# Altium project ek-ra8d2_mp - Customer.PrjPcb (part 3 of 5)

## Sheet RA8D2 MCU - Power.SchDoc
size A3; Company Name: Renesas Electronics America; CompanyURL: www.renesas.com; PageSetup: Record=PageOptions|CenterHorizontal=True|CenterVertical=True|PrintScale=1.00|XCorrection=1.00|YCorrection=1.00|PrintKind=1|BorderSize=5000000|LeftOffset=0|BottomOffset=0|Orientation=2|PaperLength=1000|PaperWidth=1000|Scale=100|PaperSource=7|PrintQuality=-4|MediaType=1|DitherType=10|PaperKind=A5 148x210mm|PrintScaleMode=1; ReleaseDate: 16.09.2025; Version: MP; SheetNumber: 10; SheetTotal: 18; VariantNumber: 0; DSheetNumber: 1
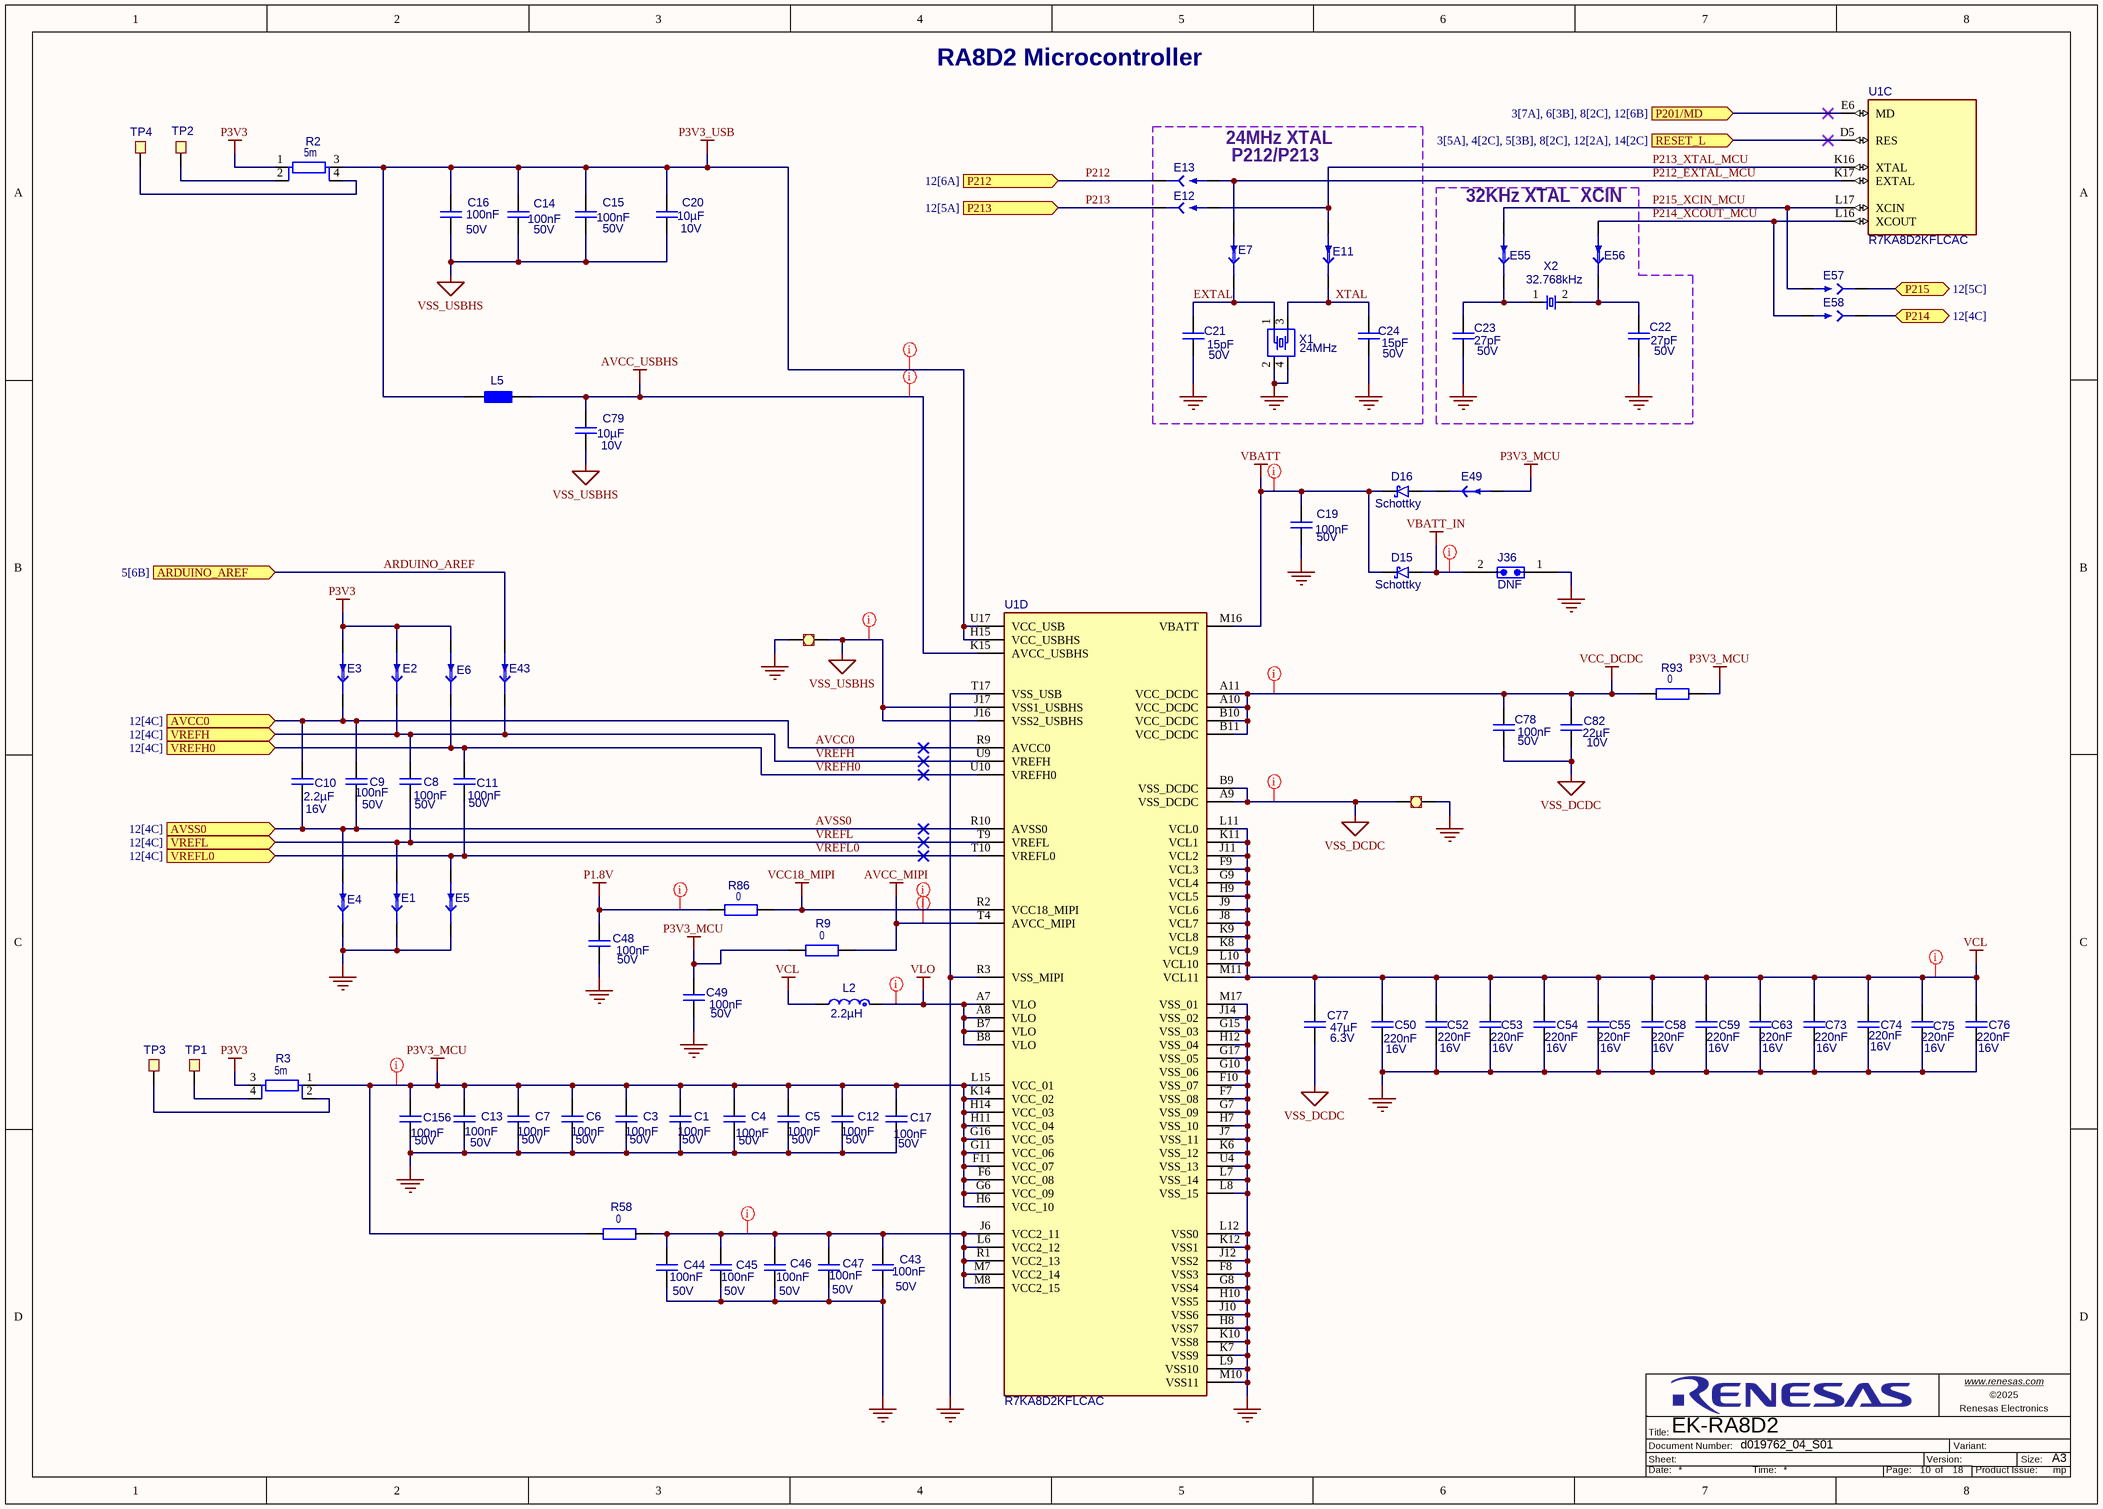
[diagram p9: RA8D2 MCU - Power.SchDoc]

### Parts
C1  value 100nF  Operating Voltage Max: 50V  [C_EIA0402_0p55]  (hidden comment: Capacitor)
C3  value 100nF  Operating Voltage Max: 50V  [C_EIA0402_0p55]  (hidden comment: Capacitor)
C4  value 100nF  Operating Voltage Max: 50V  [C_EIA0402_0p55]  (hidden comment: Capacitor)
C5  value 100nF  Operating Voltage Max: 50V  [C_EIA0402_0p55]  (hidden comment: Capacitor)
C6  value 100nF  Operating Voltage Max: 50V  [C_EIA0402_0p55]  (hidden comment: Capacitor)
C7  value 100nF  Operating Voltage Max: 50V  [C_EIA0402_0p55]  (hidden comment: Capacitor)
C8  value 100nF  Operating Voltage Max: 50V  [C_EIA0402_0p55]  (hidden comment: Capacitor)
C9  value 100nF  Operating Voltage Max: 50V  [C_EIA0402_0p55]  (hidden comment: Capacitor)
C10  value 2.2µF  Operating Voltage Max: 16V  [C_EIA0402_0p7]  (hidden comment: Capacitor)
C11  value 100nF  Operating Voltage Max: 50V  [C_EIA0402_0p55]  (hidden comment: Capacitor)
C12  value 100nF  Operating Voltage Max: 50V  [C_EIA0402_0p55]  (hidden comment: Capacitor)
C13  value 100nF  Operating Voltage Max: 50V  [C_EIA0402_0p55]  (hidden comment: Capacitor)
C14  value 100nF  Operating Voltage Max: 50V  [C_EIA0402_0p55]  (hidden comment: Capacitor)
C15  value 100nF  Operating Voltage Max: 50V  [C_EIA0402_0p55]  (hidden comment: Capacitor)
C16  value 100nF  Operating Voltage Max: 50V  [C_EIA0402_0p55]  (hidden comment: Capacitor)
C17  value 100nF  Operating Voltage Max: 50V  [C_EIA0402_0p55]  (hidden comment: Capacitor)
C19  value 100nF  Operating Voltage Max: 50V  [C_EIA0402_0p55]  (hidden comment: Capacitor)
C20  value 10µF  Operating Voltage Max: 10V  [C_EIA0402_0p7]  (hidden comment: Capacitor)
C21  value 15pF  Operating Voltage Max: 50V  [C_EIA0201_0p4]  (hidden comment: Capacitor)
C22  value 27pF  Operating Voltage Max: 50V  [C_EIA0402_0p55]  (hidden comment: Capacitor)
C23  value 27pF  Operating Voltage Max: 50V  [C_EIA0402_0p55]  (hidden comment: Capacitor)
C24  value 15pF  Operating Voltage Max: 50V  [C_EIA0201_0p4]  (hidden comment: Capacitor)
C43  value 100nF  Operating Voltage Max: 50V  [C_EIA0402_0p55]  (hidden comment: Capacitor)
C44  value 100nF  Operating Voltage Max: 50V  [C_EIA0402_0p55]  (hidden comment: Capacitor)
C45  value 100nF  Operating Voltage Max: 50V  [C_EIA0402_0p55]  (hidden comment: Capacitor)
C46  value 100nF  Operating Voltage Max: 50V  [C_EIA0402_0p55]  (hidden comment: Capacitor)
C47  value 100nF  Operating Voltage Max: 50V  [C_EIA0402_0p55]  (hidden comment: Capacitor)
C48  value 100nF  Operating Voltage Max: 50V  [C_EIA0402_0p55]  (hidden comment: Capacitor)
C49  value 100nF  Operating Voltage Max: 50V  [C_EIA0402_0p55]  (hidden comment: Capacitor)
C50  value 220nF  Operating Voltage Max: 16V  [C_EIA0402_0p55]  (hidden comment: Capacitor)
C52  value 220nF  Operating Voltage Max: 16V  [C_EIA0402_0p55]  (hidden comment: Capacitor)
C53  value 220nF  Operating Voltage Max: 16V  [C_EIA0402_0p55]  (hidden comment: Capacitor)
C54  value 220nF  Operating Voltage Max: 16V  [C_EIA0402_0p55]  (hidden comment: Capacitor)
C55  value 220nF  Operating Voltage Max: 16V  [C_EIA0402_0p55]  (hidden comment: Capacitor)
C58  value 220nF  Operating Voltage Max: 16V  [C_EIA0402_0p55]  (hidden comment: Capacitor)
C59  value 220nF  Operating Voltage Max: 16V  [C_EIA0402_0p55]  (hidden comment: Capacitor)
C63  value 220nF  Operating Voltage Max: 16V  [C_EIA0402_0p55]  (hidden comment: Capacitor)
C73  value 220nF  Operating Voltage Max: 16V  [C_EIA0402_0p55]  (hidden comment: Capacitor)
C74  value 220nF  Operating Voltage Max: 16V  [C_EIA0402_0p55]  (hidden comment: Capacitor)
C75  value 220nF  Operating Voltage Max: 16V  [C_EIA0402_0p55]  (hidden comment: Capacitor)
C76  value 220nF  Operating Voltage Max: 16V  [C_EIA0402_0p55]  (hidden comment: Capacitor)
C77  value 47µF  Operating Voltage Max: 6.3V  [C_EIA1206_1p8]  (hidden comment: GRM31CE70J476ME15L)
C78  value 100nF  Operating Voltage Max: 50V  [C_EIA0402_0p55]  (hidden comment: Capacitor)
C79  value 10µF  Operating Voltage Max: 10V  [C_EIA0402_0p7]  (hidden comment: Capacitor)
C82  value 22µF  Operating Voltage Max: 10V  [C_EIA1206_1p8]  (hidden comment: Capacitor)
C156  value 100nF  Operating Voltage Max: 50V  [C_EIA0402_0p55]  (hidden comment: Capacitor)
D15  Schottky  [roh_sod-123fl_pmdu]
D16  Schottky  [roh_sod-123fl_pmdu]
E1  TRACE_CUT_0805  [trace_cut_0805]  (value not drawn)  (net tie, no BOM)
E2  TRACE_CUT_0805  [trace_cut_0805]  (value not drawn)  (net tie, no BOM)
E3  TRACE_CUT_0805  [trace_cut_0805]  (value not drawn)  (net tie, no BOM)
E4  TRACE_CUT_0805  [trace_cut_0805]  (value not drawn)  (net tie, no BOM)
E5  TRACE_CUT_0805  [trace_cut_0805]  (value not drawn)  (net tie, no BOM)
E6  TRACE_CUT_0805  [trace_cut_0805]  (value not drawn)  (net tie, no BOM)
E7  TRACE_CUT_0805  [trace_cut_0805]  (value not drawn)  (net tie, no BOM)
E11  TRACE_CUT_0805  [trace_cut_0805]  (value not drawn)  (net tie, no BOM)
E12  SOLDER_BRIDGE_0805  [solder_bridge_0805]  (value not drawn)  (no BOM)
E13  SOLDER_BRIDGE_0805  [solder_bridge_0805]  (value not drawn)  (no BOM)
E43  TRACE_CUT_0805  [trace_cut_0805]  (value not drawn)  (net tie, no BOM)
E49  TRACE_CUT_0805  [trace_cut_0805]  (value not drawn)  (net tie, no BOM)
E55  TRACE_CUT_0805  [trace_cut_0805]  (value not drawn)  (net tie, no BOM)
E56  TRACE_CUT_0805  [trace_cut_0805]  (value not drawn)  (net tie, no BOM)
E57  SOLDER_BRIDGE_0805  [solder_bridge_0805]  (value not drawn)  (no BOM)
E58  SOLDER_BRIDGE_0805  [solder_bridge_0805]  (value not drawn)  (no BOM)
FS1  FS_Trace_120um  [force_sense_120um]  (value not drawn)  (net tie, no BOM)
FS2  FS_Trace_120um  [force_sense_120um]  (value not drawn)  (net tie, no BOM)
J36  CON_002  [wue_61300211121]  (value not drawn)
L2  value 2.2µH  [tdk_spm5020-lr]  (hidden comment: Inductor)
L5  MPZ1005S121CT000  [L_EIA0402]  (value not drawn)
R2  value 5m  [R_EIA0612]  (hidden comment: PS0612FKE070R005L)
R3  value 5m  [R_EIA0612]  (hidden comment: PS0612FKE070R005L)
R9  value 0  [R_EIA1206]  (hidden comment: Resistor)
R58  value 0  [R_EIA1206]  (hidden comment: Resistor)
R86  value 0  [R_EIA1206]  (hidden comment: Resistor)
R93  value 0  [R_EIA1206]  (hidden comment: Resistor)
TP1  TP_Mini  [key_5019]  (value not drawn)
TP2  TP_Mini  [key_5019]  (value not drawn)
TP3  TP_Mini  [key_5019]  (value not drawn)
TP4  TP_Mini  [key_5019]  (value not drawn)
U1  R7KA8D2KFLCAC  [ren_bga289_PRBG0289JA-A]  (parts C,D of 6)
X1  value 24MHz  [dio_FL]  (hidden comment: FL2400022)
X2  value 32.768kHz  [ABR_ABS07]  (hidden comment: ABS07-32.768KHZ-1-T)

### Blocks framed on the sheet
32KHz XTAL  XCIN: C22 C23 E55 E56 X2

### Ports
ARDUINO_AREF (in, see 5[6B]), AVCC0 (in, see 12[4C]), AVSS0 (in, see 12[4C]), P201/MD (in, see 3[7A], 6[3B], 8[2C], 12[6B]), P212 (in, see 12[6A]), P213 (in, see 12[5A]), P214 (bidir, see 12[4C]), P215 (bidir, see 12[5C]), RESET_L (in, see 3[5A], 4[2C], 5[3B], 8[2C], 12[2A], 14[2C]), VREFH0 (in, see 12[4C]), VREFH (in, see 12[4C]), VREFL0 (in, see 12[4C]), VREFL (in, see 12[4C])

### Nets
AVCC_MIPI: R9.2 U1.T4(AVCC_MIPI)
AVCC_USBHS: C79.1 L5.1 U1.K15(AVCC_USBHS)
GND: C1.1 C3.1 C4.1 C5.1 C6.1 C7.1 C12.1 C13.1 C17.1 C19.2 C21.2 C22.2 C23.2 C24.2 C43.1 C44.1 C45.1 C46.1 C47.1 C48.2 C49.2 C50.2 C52.2 C53.2 C54.2 C55.2 C58.2 C59.2 C63.2 C73.2 C74.2 C75.2 C76.2 C156.1 E1.1 E4.1 E5.1 FS1.1 FS2.2 J36.1 U1.F7(VSS_08) U1.F8(VSS3) U1.F10(VSS_07) U1.G7(VSS_09) U1.G8(VSS4) U1.G10(VSS_06) U1.G15(VSS_03) U1.G17(VSS_05) U1.H7(VSS_10) U1.H8(VSS7) U1.H10(VSS5) U1.H12(VSS_04) U1.J7(VSS_11) U1.J10(VSS6) U1.J12(VSS2) U1.J14(VSS_02) U1.K6(VSS_12) U1.K7(VSS9) U1.K10(VSS8) U1.K12(VSS1) U1.L7(VSS_14) U1.L8(VSS_15) U1.L9(VSS10) U1.L12(VSS0) U1.M10(VSS11) U1.M17(VSS_01) U1.R3(VSS_MIPI) U1.T17(VSS_USB) U1.U4(VSS_13) X1.2 X1.4
P1.8V: C48.1 R86.1
P3V3: E2.2 E3.2 E6.2 R2.1 R3.3
P3V3_MCU: C1.2 C3.2 C4.2 C5.2 C6.2 C7.2 C12.2 C13.2 C17.2 C49.1 C156.2 E49.2 R3.1 R9.1 R58.2 R93.2 U1.F6(VCC_08) U1.F11(VCC_07) U1.G6(VCC_09) U1.G11(VCC_06) U1.G16(VCC_05) U1.H6(VCC_10) U1.H11(VCC_04) U1.H14(VCC_03) U1.K14(VCC_02) U1.L15(VCC_01)
P3V3_USB: C14.1 C15.1 C16.1 C20.1 L5.2 R2.3 U1.H15(VCC_USBHS) U1.U17(VCC_USB)
VBATT: C19.1 D15.1(K) D16.1(K) U1.M16(VBATT)
VBATT_IN: D15.2(A) J36.2
VCC18_MIPI: R86.2 U1.R2(VCC18_MIPI)
VCC_DCDC: C78.1 C82.1 R93.1 U1.A10(VCC_DCDC) U1.A11(VCC_DCDC) U1.B10(VCC_DCDC) U1.B11(VCC_DCDC)
VCL: C50.1 C52.1 C53.1 C54.1 C55.1 C58.1 C59.1 C63.1 C73.1 C74.1 C75.1 C76.1 C77.1 L2.2 U1.F9(VCL3) U1.G9(VCL4) U1.H9(VCL5) U1.J8(VCL7) U1.J9(VCL6) U1.J11(VCL2) U1.K8(VCL9) U1.K9(VCL8) U1.K11(VCL1) U1.L10(VCL10) U1.L11(VCL0) U1.M11(VCL11)
VLO: L2.1 U1.A7(VLO) U1.A8(VLO) U1.B7(VLO) U1.B8(VLO)
VSS_DCDC: C77.2 C78.2 C82.2 FS2.1 U1.A9(VSS_DCDC) U1.B9(VSS_DCDC)
VSS_USBHS: C14.2 C15.2 C16.2 C20.2 C79.2 FS1.2 U1.J16(VSS2_USBHS) U1.J17(VSS1_USBHS)
ARDUINO_AREF: E43.2 ; port ARDUINO_AREF
AVCC0: C9.1 C10.2 E3.1 U1.R9(AVCC0) ; port AVCC0
AVSS0: C9.2 C10.1 E4.2 U1.R10(AVSS0) ; port AVSS0
EXTAL: C21.1 E7.1 X1.1
P201/MD: U1.E6(MD) ; port P201/MD
P212: E13.1 ; port P212
P212_EXTAL_MCU: E7.2 E13.2 U1.K17(EXTAL)
P213: E12.1 ; port P213
P213_XTAL_MCU: E11.2 E12.2 U1.K16(XTAL)
P214: E58.1 ; port P214
P214_XCOUT_MCU: E56.2 E58.2 U1.L16(XCOUT)
P215: E57.1 ; port P215
P215_XCIN_MCU: E55.2 E57.2 U1.L17(XCIN)
RESET_L: U1.D5(RES) ; port RESET_L
VREFH: C8.1 E2.1 E43.1 U1.U9(VREFH) ; port VREFH
VREFH0: C11.1 E6.1 U1.U10(VREFH0) ; port VREFH0
VREFL: C8.2 E1.2 U1.T9(VREFL) ; port VREFL
VREFL0: C11.2 E5.2 U1.T10(VREFL0) ; port VREFL0
XTAL: C24.1 E11.1 X1.3
NetC22_1: C22.1 E56.1 X2.2
NetC23_1: C23.1 E55.1 X2.1
NetC43_2: C43.2 C44.2 C45.2 C46.2 C47.2 R58.1 U1.J6(VCC2_11) U1.L6(VCC2_12) U1.M7(VCC2_14) U1.M8(VCC2_15) U1.R1(VCC2_13)
NetD16_2: D16.2(A) E49.1
NetR2_2: R2.2 TP2.1
NetR2_4: R2.4 TP4.1
NetR3_2: R3.2 TP3.1
NetR3_4: R3.4 TP1.1

### Layout directives
net class Power; rule Supply Nets [Voltage = 3.300]: NetC43_2, P1.8V, P3V3_MCU, VBATT, VBATT_IN, VCC_DCDC
net class Power; rule Supply Nets [Voltage = 1.200]: AVCC_USBHS, P3V3_USB, VCL, VLO
net class Power; rule Supply Nets [Voltage = 1.800]: AVCC_MIPI, VCC18_MIPI
net class Power; rule Supply Nets [Voltage = 0.000]: VSS_DCDC, VSS_USBHS

### Notes on the sheet
- RA8D2 Microcontroller
- (near E13) P212/P213
- 24MHz XTAL
- www.renesas.com <http://www.renesas.com>
- Sheet:
- Title:
- Document Number:
- Version:
- Variant:
- Renesas Electronics
- Size:
- A3
- Date:
- Time:
- Page:
- of
- Product Issue:

### Library data of the parts
C1 C3-C9 C11-C17 C19 C43-C49 C78 C156 = CAP-00003203-9: as C51 on sheet J-Link On Board with RA4M2; Dielectric: X7R; Height: 550µm; Operating Temperature Max: 125°C; Operating Temperature Min: -55°C
C10 = CAP-00000015-4: Capacitor,EIA0402,2.2u,16V,X6S; Tolerance: 10%; Qualification: AEC-Q200; Subtype: MLCC; Dielectric: X6S; Height: 700µm; Operating Temperature Max: 105°C; Operating Temperature Min: -55°C
C20 C79 = CAP-00003447-8: Capacitor,EIA0402,10u,10V,X5R; Tolerance: 20%; Subtype: MLCC; Dielectric: X5R; Height: 700µm; Operating Temperature Max: 85°C; Operating Temperature Min: -55°C; Qualification: -
C21 C24 = CAP-00000012-4: Capacitor,EIA0201,15p,50V,C0G; Tolerance: 1%; Qualification: AEC-Q200; Subtype: MLCC; Dielectric: C0G; Height: 390µm; Operating Temperature Max: 125°C; Operating Temperature Min: -55°C
C22 C23 = CAP-00003477-9: Capacitor,EIA0402,27p,50V,C0G; Tolerance: 5%; Subtype: MLCC; Remarks: ANY EQUIVALENT; Dielectric: C0G; Height: 550µm; Operating Temperature Max: 125°C; Operating Temperature Min: -55°C; Qualification: -
C50 C52-C55 C58 C59 C63 C73-C76 = CAP-00003208-9: Capacitor,EIA0402,220n,16V,X7R; Tolerance: 10%; Qualification: AEC-Q200; Subtype: MLCC; Dielectric: X7R; Height: 550µm; Operating Temperature Max: 125°C; Operating Temperature Min: -55°C
C77 = CAP-00003371-7: Capacitor,EIA1206,47u,6.3V,X7U; Tolerance: 20%; Subtype: MLCC; Operating Temperature Max: 125°C; Operating Temperature Min: -55°C; Dielectric: X7U; Height: 1.6mm; Qualification: -
C82 = CAP-00003207-7: Capacitor,EIA1206,22u,10V,X7R; Tolerance: 10%; Qualification: AEC-Q200; Subtype: MLCC; Dielectric: X7R; Height: 1.8mm; Operating Temperature Max: 125°C; Operating Temperature Min: -55°C
D15 D16 = DIO-00000005-3: Rectifier Diode, Schottky, 1 Phase, 1 Element, 1A, 40V V(RRM), Silicon; Forward Voltage: 600mV; Qualification: AEC-Q101; Current: 1A; Height: 900µm; Operating Temperature Max: 150°C; Operating Temperature Min: -55°C; Reverse Voltage: 40V; Subtype: Schottky
E1-E7 E11 E43 E49 E55 E56 = MIS-00000000-11: Trace Cut, SMD, 0805 size; Value: TC; Pin Count: 2; Qualification: -; Subtype: Trace Cut
E12 E13 E57 E58 = MIS-00000002-7: Solder Bridge, SMD, 0805 size; Value: SB; Subtype: Solder Bridge; Qualification: -; Pin Count: 2
FS1 FS2 = MIS-00003418-12: Force-Sense Trace 120um; Subtype: Force Sense; Value: FS Trace; Pin Count: 2; Qualification: -
J36 = CON-00003283-14: Header,2way,1row,vertical,2.54mm,THT; Current: 3A; DC Resistance: 20m; Gender: male; Operating Voltage Max: 250V; Height: 8.89mm; Operating Temperature Max: 105°C; Operating Temperature Min: -40°C; Pin Count: 2; Qualification: -; DNF: DNF
L2 = IND-00000003-3: Inductor, 2.2uH, 20%, 7A, Metal-Core; DC Resistance: 37m; Frequency: 100kHz; Subtype: Fixed; Current: 7A; Tolerance: 20%; Height: 2mm; Operating Temperature Max: 125°C; Operating Temperature Min: -40°C; Qualification: -
L5 = IND-00000008-7: Ferrite Chip, 1.2A, 90mOhm DCR, 120Ohm Impedance @100MHz; Tolerance: 25%; DC Resistance: 90m; Frequency: 100MHz; Value: 120; Current: 1.2A; Height: 550µm; Operating Temperature Max: 125°C; Operating Temperature Min: -55°C; Qualification: -; Subtype: Ferrite
R2 R3 = RES-00003207-8: Current Sense Resistor,EIA0612,5m,1W; Tolerance: 1%; Subtype: Chip Resistor; Power: 1W; Height: 800µm; Operating Temperature Max: 155°C; Operating Temperature Min: -55°C; Qualification: -
R9 R58 R86 R93 = RES-00000804-8: Resistor,EIA1206,0,0.25W; Power: 250mW; Tolerance: 5%; Subtype: Chip Resistor; Operating Temperature Max: 155°C; Operating Temperature Min: -55°C; Qualification: -
TP1-TP4 = MIS-00003478-10: Testpoint Miniature; Value: TP; Pin Count: 1; Qualification: -; Subtype: Testpoint
U1 = ICS-00000098-4: Renesas RA8D2 32-bit MCU, High-performance 1 GHz Arm® Cortex®-M85 core, 250 MHz Arm® Cortex®-M33 core, up to 1 MB code MRAM, and 2 MB SRAM with ECC; Subtype: MCU/MPU; Operating Voltage Min: 1.62V; Frequency: 1GHz; Operating Voltage Max: 3.63V; Qualification: -; Operating Temperature Max: 95°C; Pin Count: 289; Operating Temperature Min: 0°C
X1 = CRY-00000005-11: Crystal, 24MHz, 10pF, 3.2x2.5; Tolerance: 10ppm; Height: 650µm; Load Capacitance: 10pF; Operating Temperature Max: -25°C; Operating Temperature Min: 85°C; Qualification: -; Subtype: Crystal
X2 = CRY-00000004-4: Crystal, 32.768kHz, 12.5pF, 3.2x1.5; Tolerance: 10ppm; Load Capacitance: 12.5pF; Operating Temperature Min: -40°C; Temperature Coefficient: -; Qualification: -; Subtype: Crystal; Operating Temperature Max: 85°C; Height: 900µm

## Sheet CEU Camera.SchDoc
size A3; Company Name: Renesas Electronics America; CompanyURL: www.renesas.com; PageSetup: Record=PageOptions|CenterHorizontal=True|CenterVertical=True|PrintScale=1.00|XCorrection=1.00|YCorrection=1.00|PrintKind=1|BorderSize=5000000|LeftOffset=0|BottomOffset=0|Orientation=2|PaperLength=1000|PaperWidth=1000|Scale=100|PaperSource=7|PrintQuality=-4|MediaType=1|DitherType=10|PaperKind=A5 148x210mm|PrintScaleMode=1; ReleaseDate: 16.09.2025; Version: MP; SheetNumber: 11; SheetTotal: 18; VariantNumber: 0; DSheetNumber: 1
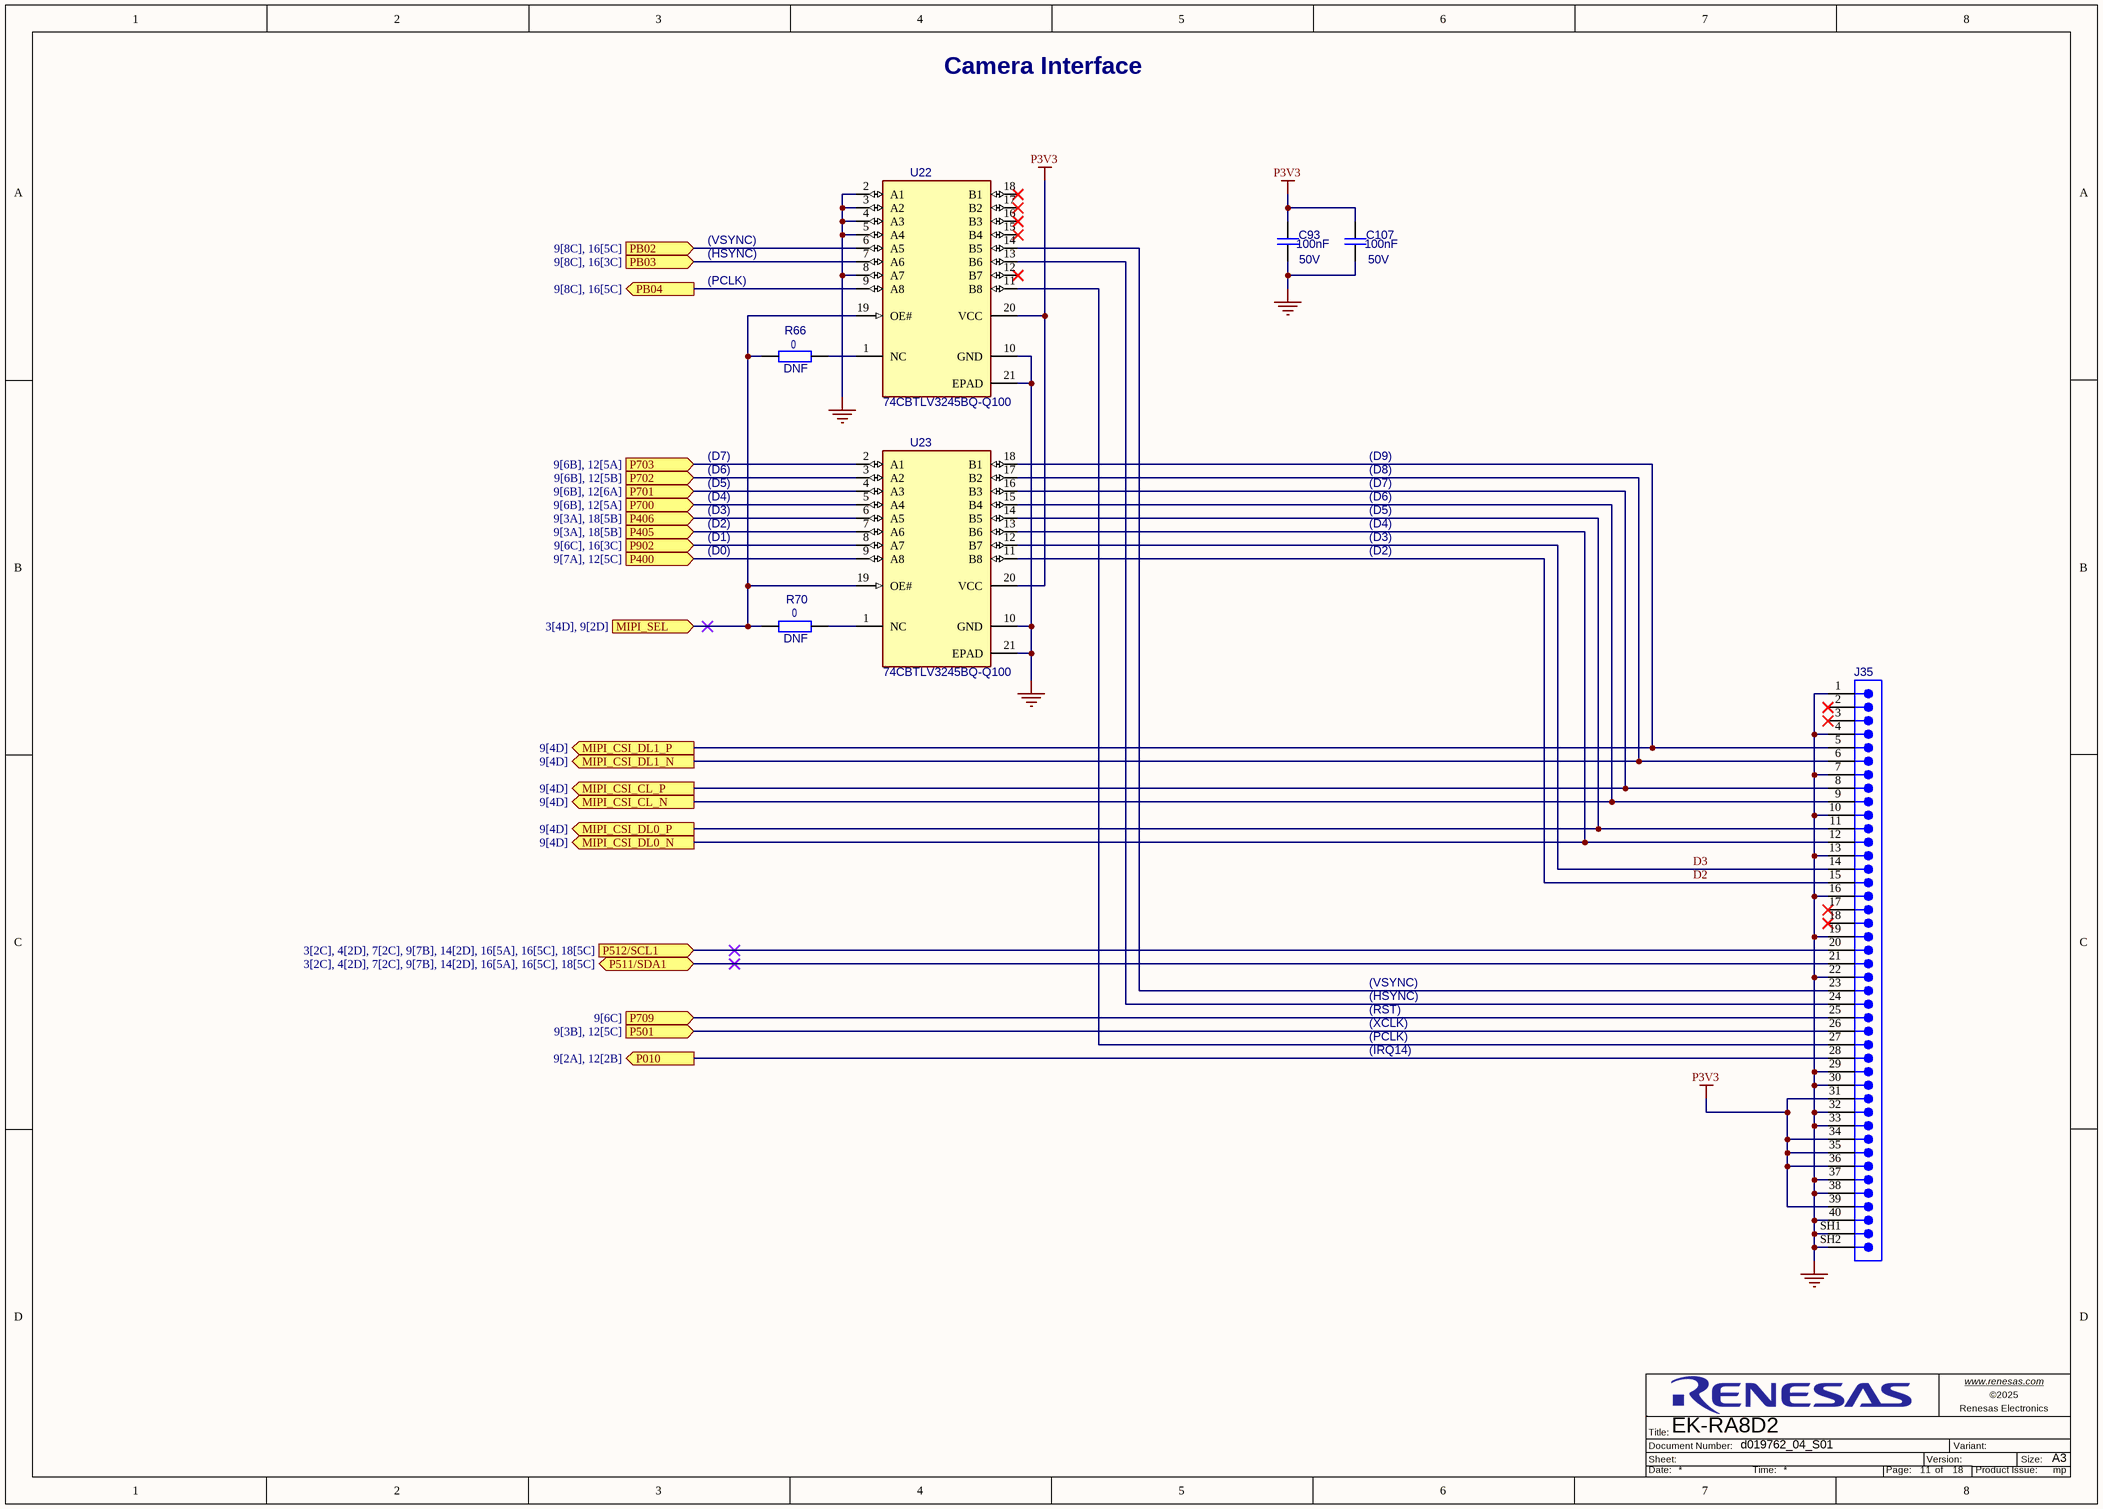
[diagram p10: CEU Camera.SchDoc]

### Parts
C93  value 100nF  Operating Voltage Max: 50V  [C_EIA0402_0p55]  (hidden comment: Capacitor)
C107  value 100nF  Operating Voltage Max: 50V  [C_EIA0402_0p55]  (hidden comment: Capacitor)
J35  505110-4091  [mol_505110-4091]  (value not drawn)
R66  value 0  [R_EIA0402]  (hidden comment: Resistor)
R70  value 0  [R_EIA0402]  (hidden comment: Resistor)
U22  74CBTLV3245BQ-Q100  [nex_SOT-764-1_DHVQFN20]
U23  74CBTLV3245BQ-Q100  [nex_SOT-764-1_DHVQFN20]

### Ports
MIPI_CSI_CL_N (out, see 9[4D]), MIPI_CSI_CL_P (out, see 9[4D]), MIPI_CSI_DL0_N (out, see 9[4D]), MIPI_CSI_DL0_P (out, see 9[4D]), MIPI_CSI_DL1_N (out, see 9[4D]), MIPI_CSI_DL1_P (out, see 9[4D]), MIPI_SEL (in, see 3[4D], 9[2D]), P010 (out, see 9[2A], 12[2B]), P400 (in, see 9[7A], 12[5C]), P405 (in, see 9[3A], 18[5B]), P406 (in, see 9[3A], 18[5B]), P501 (in, see 9[3B], 12[5C]), P511/SDA1 (bidir, see 3[2C], 4[2D], 7[2C], 9[7B], 14[2D], 16[5A], 16[5C], 18[5C]), P512/SCL1 (in, see 3[2C], 4[2D], 7[2C], 9[7B], 14[2D], 16[5A], 16[5C], 18[5C]), P700 (in, see 9[6B], 12[5A]), P701 (in, see 9[6B], 12[6A]), P702 (in, see 9[6B], 12[5B]), P703 (in, see 9[6B], 12[5A]), P709 (in, see 9[6C]), P902 (in, see 9[6C], 16[3C]), PB02 (in, see 9[8C], 16[5C]), PB03 (in, see 9[8C], 16[3C]), PB04 (out, see 9[8C], 16[5C])

### Nets
GND: C93.1 C107.1 J35.1 J35.4 J35.7 J35.10 J35.13 J35.16 J35.19 J35.22 J35.29 J35.30 J35.32 J35.33 J35.37 J35.38 J35.40 J35.SH1 J35.SH2 U22.2(A1) U22.3(A2) U22.4(A3) U22.5(A4) U22.8(A7) U22.10(GND) U22.21(EPAD) U23.10(GND) U23.21(EPAD)
P3V3: C93.2 C107.2 J35.31 J35.34 J35.35 J35.36 J35.39 U22.20(VCC) U23.20(VCC)
D2: J35.15 U23.11(B8)
D3: J35.14 U23.12(B7)
MIPI_CSI_CL_N: J35.9 U23.15(B4) ; port MIPI_CSI_CL_N
MIPI_CSI_CL_P: J35.8 U23.16(B3) ; port MIPI_CSI_CL_P
MIPI_CSI_DL0_N: J35.12 U23.13(B6) ; port MIPI_CSI_DL0_N
MIPI_CSI_DL0_P: J35.11 U23.14(B5) ; port MIPI_CSI_DL0_P
MIPI_CSI_DL1_N: J35.6 U23.17(B2) ; port MIPI_CSI_DL1_N
MIPI_CSI_DL1_P: J35.5 U23.18(B1) ; port MIPI_CSI_DL1_P
MIPI_SEL: R66.1 R70.1 U22.19(OE#) U23.19(OE#) ; port MIPI_SEL
P010: J35.28 ; port P010
P400: U23.9(A8) ; port P400
P405: U23.7(A6) ; port P405
P406: U23.6(A5) ; port P406
P501: J35.26 ; port P501
P511/SDA1: J35.21 ; port P511/SDA1
P512/SCL1: J35.20 ; port P512/SCL1
P700: U23.5(A4) ; port P700
P701: U23.4(A3) ; port P701
P702: U23.3(A2) ; port P702
P703: U23.2(A1) ; port P703
P709: J35.25 ; port P709
P902: U23.8(A7) ; port P902
PB02: U22.6(A5) ; port PB02
PB03: U22.7(A6) ; port PB03
PB04: U22.9(A8) ; port PB04
NetJ35_23: J35.23 U22.14(B5)
NetJ35_24: J35.24 U22.13(B6)
NetJ35_27: J35.27 U22.11(B8)
NetR66_2: R66.2 U22.1(NC)
NetR70_2: R70.2 U23.1(NC)

Not connected (* = marked no-connect by the designer): J35 2* 3* 17* 18*; U22 12(B7)* 15(B4)* 16(B3)* 17(B2)* 18(B1)*

### Notes on the sheet
- Camera Interface
- (VSYNC)
- (HSYNC)
- (PCLK)
- (D6)
- (D4)
- (D7)
- (D5)
- (D3)
- (D9)
- (D8)
- (D0)
- (D1)
- (D2)
- (IRQ14)
- (RST)
- (XCLK)
- www.renesas.com <http://www.renesas.com>
- Sheet:
- Title:
- Document Number:
- Version:
- Variant:
- Renesas Electronics
- Size:
- A3
- Date:
- Time:
- Page:
- of
- Product Issue:

### Library data of the parts
C93 C107 = CAP-00003203-9: as C51 on sheet J-Link On Board with RA4M2; Dielectric: X7R; Height: 550µm; Operating Temperature Max: 125°C; Operating Temperature Min: -55°C
J35 = CON-00000066-2: FFC/FPC Connector, 40 Contact(s), 1 Row(s), Female, Right Angle, 0.019 inch Pitch, Surface Mount Terminal, Locking, Beige Insulator; Operating Voltage Max: 50V; Current: 500mA; Operating Temperature Max: 105°C; Gender: female; Qualification: -; Pin Count: 42; Height: 1.9mm; Operating Temperature Min: -40°C
R66 R70 = RES-00000801-9: Resistor,EIA0402,0,0.0625W; Power: 62.5mW; Tolerance: 5%; Subtype: Chip Resistor; Operating Temperature Max: 155°C; Operating Temperature Min: -55°C; Qualification: -; DNF: DNF
U22 U23 = ICS-00000017-5: Octal FET Bus Switch, 5 ohm, 0.3ns max delay, DHVQFN20; Current: 128mA; Operating Voltage Max: 3.6V; Operating Voltage Min: 2.3V; Output Voltage Min: 0V; Qualification: AEC-Q100; Operating Temperature Max: 125°C; Operating Temperature Min: -40°C; Output Voltage Max: 3.6V; Pin Count: 21; Subtype: Bus Switch

## Sheet Pin Headers.SchDoc
size A3; Company Name: Renesas Electronics America; CompanyURL: www.renesas.com; PageSetup: Record=PageOptions|CenterHorizontal=True|CenterVertical=True|PrintScale=1.00|XCorrection=1.00|YCorrection=1.00|PrintKind=1|BorderSize=5000000|LeftOffset=0|BottomOffset=0|Orientation=2|PaperLength=1000|PaperWidth=1000|Scale=100|PaperSource=7|PrintQuality=-4|MediaType=1|DitherType=10|PaperKind=A5 148x210mm|PrintScaleMode=1; ReleaseDate: 16.09.2025; Version: MP; SheetNumber: 12; SheetTotal: 18; VariantNumber: 0; DSheetNumber: 1
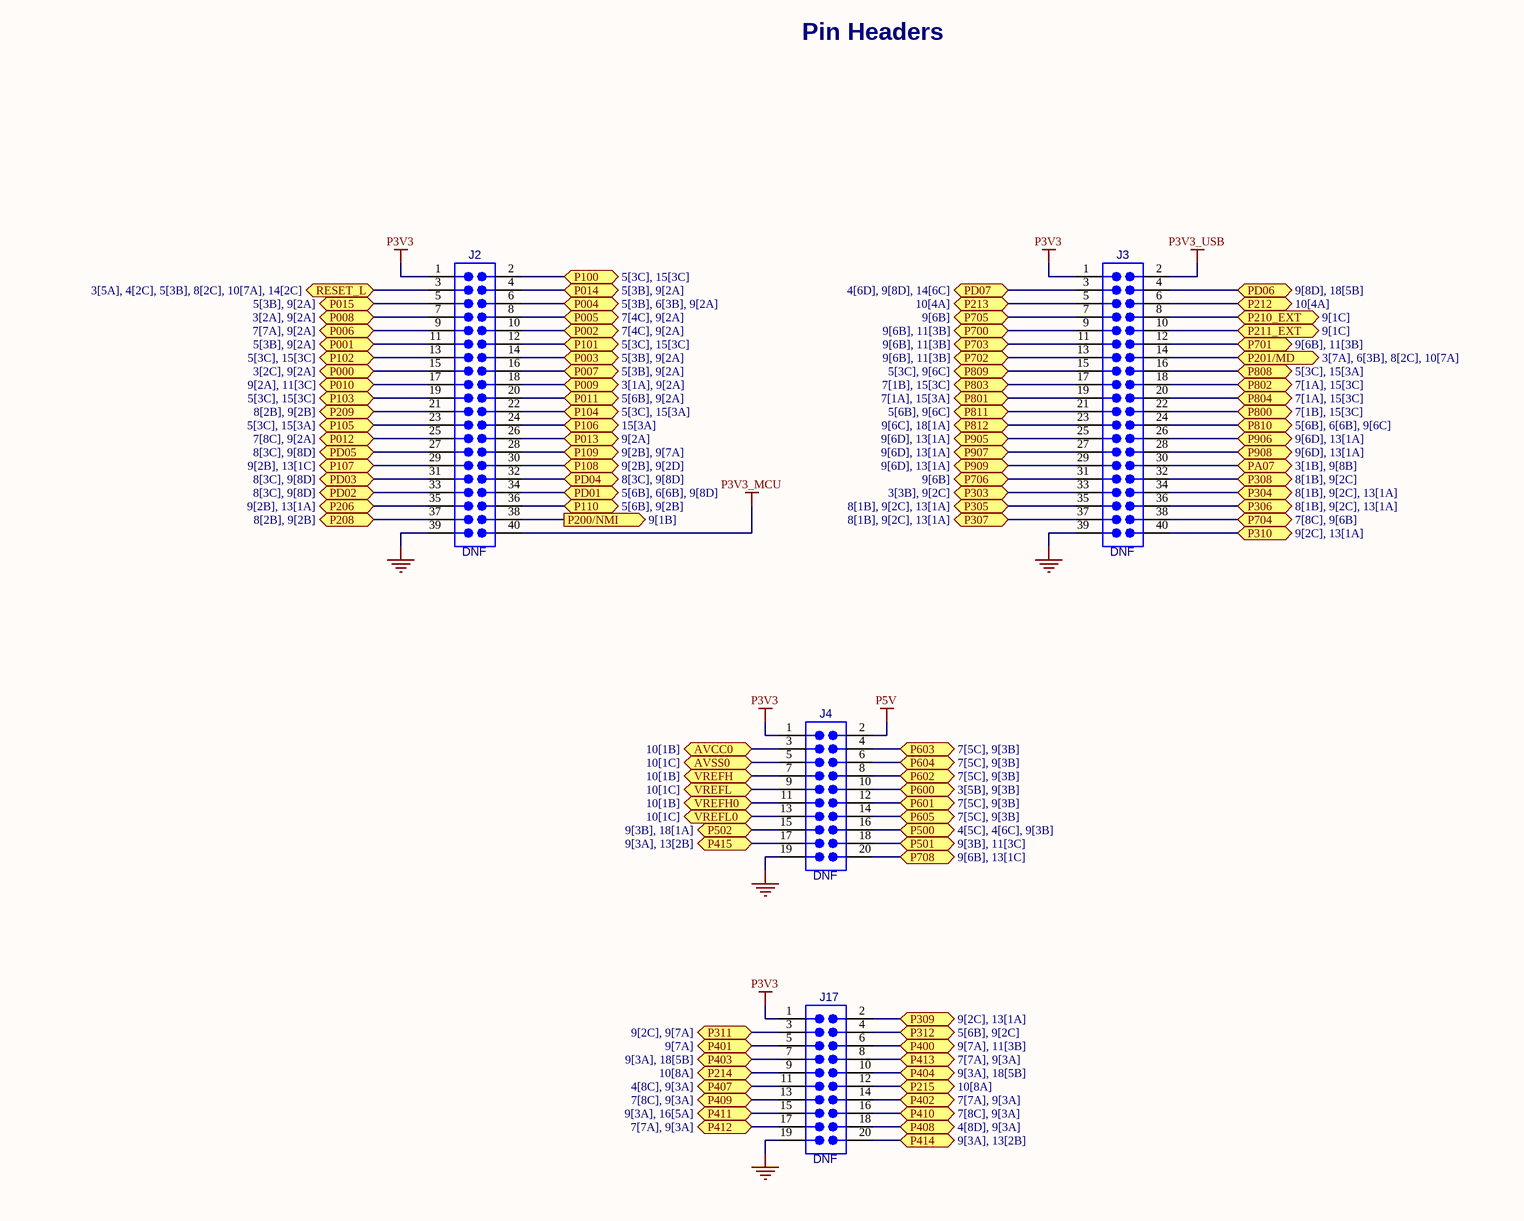
[diagram p11: Pin Headers.SchDoc]

### Parts
J2  CON_040  [wue_61304021121]  (value not drawn)
J3  CON_040  [wue_61304021121]  (value not drawn)
J4  CON_020  [wue_61302021121]  (value not drawn)
J17  CON_020  [wue_61302021121]  (value not drawn)

### Ports
AVCC0 (bidir, see 10[1B]), AVSS0 (bidir, see 10[1C]), P000 (bidir, see 3[2C], 9[2A]), P001 (bidir, see 5[3B], 9[2A]), P002 (bidir, see 7[4C], 9[2A]), P003 (bidir, see 5[3B], 9[2A]), P004 (bidir, see 5[3B], 6[3B], 9[2A]), P005 (bidir, see 7[4C], 9[2A]), P006 (bidir, see 7[7A], 9[2A]), P007 (bidir, see 5[3B], 9[2A]), P008 (bidir, see 3[2A], 9[2A]), P009 (bidir, see 3[1A], 9[2A]), P010 (bidir, see 9[2A], 11[3C]), P011 (bidir, see 5[6B], 9[2A]), P012 (bidir, see 7[8C], 9[2A]), P013 (bidir, see 9[2A]), P014 (bidir, see 5[3B], 9[2A]), P015 (bidir, see 5[3B], 9[2A]), P100 (bidir, see 5[3C], 15[3C]), P101 (bidir, see 5[3C], 15[3C]), P102 (bidir, see 5[3C], 15[3C]), P103 (bidir, see 5[3C], 15[3C]), P104 (bidir, see 5[3C], 15[3A]), P105 (bidir, see 5[3C], 15[3A]), P106 (bidir, see 15[3A]), P107 (bidir, see 9[2B], 13[1C]), P108 (bidir, see 9[2B], 9[2D]), P109 (bidir, see 9[2B], 9[7A]), P110 (bidir, see 5[6B], 9[2B]), P200/NMI (out, see 9[1B]), P201/MD (bidir, see 3[7A], 6[3B], 8[2C], 10[7A]), P206 (bidir, see 9[2B], 13[1A]), P208 (bidir, see 8[2B], 9[2B]), P209 (bidir, see 8[2B], 9[2B]), P210_EXT (bidir, see 9[1C]), P211_EXT (bidir, see 9[1C]), P212 (bidir, see 10[4A]), P213 (bidir, see 10[4A]), P214 (bidir, see 10[8A]), P215 (bidir, see 10[8A]), P303 (bidir, see 3[3B], 9[2C]), P304 (bidir, see 8[1B], 9[2C], 13[1A]), P305 (bidir, see 8[1B], 9[2C], 13[1A]), P306 (bidir, see 8[1B], 9[2C], 13[1A]), P307 (bidir, see 8[1B], 9[2C], 13[1A]), P308 (bidir, see 8[1B], 9[2C]), P309 (bidir, see 9[2C], 13[1A]), P310 (bidir, see 9[2C], 13[1A]), P311 (bidir, see 9[2C], 9[7A]), P312 (bidir, see 5[6B], 9[2C]), P400 (bidir, see 9[7A], 11[3B]), P401 (bidir, see 9[7A]), P402 (bidir, see 7[7A], 9[3A]), P403 (bidir, see 9[3A], 18[5B]), P404 (bidir, see 9[3A], 18[5B]), P407 (bidir, see 4[8C], 9[3A]), P408 (bidir, see 4[8D], 9[3A]), P409 (bidir, see 7[8C], 9[3A]), P410 (bidir, see 7[8C], 9[3A]), P411 (bidir, see 9[3A], 16[5A]), P412 (bidir, see 7[7A], 9[3A]), P413 (bidir, see 7[7A], 9[3A]), P414 (bidir, see 9[3A], 13[2B]), P415 (bidir, see 9[3A], 13[2B]), P500 (bidir, see 4[5C], 4[6C], 9[3B]), P501 (bidir, see 9[3B], 11[3C]), P502 (bidir, see 9[3B], 18[1A]), P600 (bidir, see 3[5B], 9[3B]), P601 (bidir, see 7[5C], 9[3B]), P602 (bidir, see 7[5C], 9[3B]), P603 (bidir, see 7[5C], 9[3B]), P604 (bidir, see 7[5C], 9[3B]), P605 (bidir, see 7[5C], 9[3B]), P700 (bidir, see 9[6B], 11[3B]), P701 (bidir, see 9[6B], 11[3B]), P702 (bidir, see 9[6B], 11[3B]), P703 (bidir, see 9[6B], 11[3B]), P704 (bidir, see 7[8C], 9[6B]), P705 (bidir, see 9[6B]), P706 (bidir, see 9[6B]), P708 (bidir, see 9[6B], 13[1C]), P800 (bidir, see 7[1B], 15[3C]), P801 (bidir, see 7[1A], 15[3A]), P802 (bidir, see 7[1A], 15[3C]), P803 (bidir, see 7[1B], 15[3C]), P804 (bidir, see 7[1A], 15[3C]), P808 (bidir, see 5[3C], 15[3A]), P809 (bidir, see 5[3C], 9[6C]), P810 (bidir, see 5[6B], 6[6B], 9[6C]), P811 (bidir, see 5[6B], 9[6C]), P812 (bidir, see 9[6C], 18[1A]), P905 (bidir, see 9[6D], 13[1A]), P906 (bidir, see 9[6D], 13[1A]), P907 (bidir, see 9[6D], 13[1A]), P908 (bidir, see 9[6D], 13[1A]), P909 (bidir, see 9[6D], 13[1A]), PA07 (bidir, see 3[1B], 9[8B]), PD01 (bidir, see 5[6B], 6[6B], 9[8D]), PD02 (bidir, see 8[3C], 9[8D]), PD03 (bidir, see 8[3C], 9[8D]), PD04 (bidir, see 8[3C], 9[8D]), PD05 (bidir, see 8[3C], 9[8D]), PD06 (bidir, see 9[8D], 18[5B]), PD07 (bidir, see 4[6D], 9[8D], 14[6C]), RESET_L (bidir, see 3[5A], 4[2C], 5[3B], 8[2C], 10[7A], 14[2C]), VREFH0 (bidir, see 10[1B]), VREFH (bidir, see 10[1B]), VREFL0 (bidir, see 10[1C]), VREFL (bidir, see 10[1C])

### Nets
GND: J2.39 J3.39 J4.19 J17.19
P3V3: J2.1 J3.1 J4.1 J17.1
P3V3_MCU: J2.40
P3V3_USB: J3.2
P5V: J4.2
AVCC0: J4.3 ; port AVCC0
AVSS0: J4.5 ; port AVSS0
P000: J2.15 ; port P000
P001: J2.11 ; port P001
P002: J2.10 ; port P002
P003: J2.14 ; port P003
P004: J2.6 ; port P004
P005: J2.8 ; port P005
P006: J2.9 ; port P006
P007: J2.16 ; port P007
P008: J2.7 ; port P008
P009: J2.18 ; port P009
P010: J2.17 ; port P010
P011: J2.20 ; port P011
P012: J2.25 ; port P012
P013: J2.26 ; port P013
P014: J2.4 ; port P014
P015: J2.5 ; port P015
P100: J2.2 ; port P100
P101: J2.12 ; port P101
P102: J2.13 ; port P102
P103: J2.19 ; port P103
P104: J2.22 ; port P104
P105: J2.23 ; port P105
P106: J2.24 ; port P106
P107: J2.29 ; port P107
P108: J2.30 ; port P108
P109: J2.28 ; port P109
P110: J2.36 ; port P110
P200/NMI: J2.38 ; port P200/NMI
P201/MD: J3.14 ; port P201/MD
P206: J2.35 ; port P206
P208: J2.37 ; port P208
P209: J2.21 ; port P209
P210_EXT: J3.8 ; port P210_EXT
P211_EXT: J3.10 ; port P211_EXT
P212: J3.6 ; port P212
P213: J3.5 ; port P213
P214: J17.9 ; port P214
P215: J17.12 ; port P215
P303: J3.33 ; port P303
P304: J3.34 ; port P304
P305: J3.35 ; port P305
P306: J3.36 ; port P306
P307: J3.37 ; port P307
P308: J3.32 ; port P308
P309: J17.2 ; port P309
P310: J3.40 ; port P310
P311: J17.3 ; port P311
P312: J17.4 ; port P312
P400: J17.6 ; port P400
P401: J17.5 ; port P401
P402: J17.14 ; port P402
P403: J17.7 ; port P403
P404: J17.10 ; port P404
P407: J17.11 ; port P407
P408: J17.18 ; port P408
P409: J17.13 ; port P409
P410: J17.16 ; port P410
P411: J17.15 ; port P411
P412: J17.17 ; port P412
P413: J17.8 ; port P413
P414: J17.20 ; port P414
P415: J4.17 ; port P415
P500: J4.16 ; port P500
P501: J4.18 ; port P501
P502: J4.15 ; port P502
P600: J4.10 ; port P600
P601: J4.12 ; port P601
P602: J4.8 ; port P602
P603: J4.4 ; port P603
P604: J4.6 ; port P604
P605: J4.14 ; port P605
P700: J3.9 ; port P700
P701: J3.12 ; port P701
P702: J3.13 ; port P702
P703: J3.11 ; port P703
P704: J3.38 ; port P704
P705: J3.7 ; port P705
P706: J3.31 ; port P706
P708: J4.20 ; port P708
P800: J3.22 ; port P800
P801: J3.19 ; port P801
P802: J3.18 ; port P802
P803: J3.17 ; port P803
P804: J3.20 ; port P804
P808: J3.16 ; port P808
P809: J3.15 ; port P809
P810: J3.24 ; port P810
P811: J3.21 ; port P811
P812: J3.23 ; port P812
P905: J3.25 ; port P905
P906: J3.26 ; port P906
P907: J3.27 ; port P907
P908: J3.28 ; port P908
P909: J3.29 ; port P909
PA07: J3.30 ; port PA07
PD01: J2.34 ; port PD01
PD02: J2.33 ; port PD02
PD03: J2.31 ; port PD03
PD04: J2.32 ; port PD04
PD05: J2.27 ; port PD05
PD06: J3.4 ; port PD06
PD07: J3.3 ; port PD07
RESET_L: J2.3 ; port RESET_L
VREFH: J4.7 ; port VREFH
VREFH0: J4.11 ; port VREFH0
VREFL: J4.9 ; port VREFL
VREFL0: J4.13 ; port VREFL0

### Notes on the sheet
- Pin Headers
- www.renesas.com <http://www.renesas.com>
- Sheet:
- Title:
- Document Number:
- Version:
- Variant:
- Renesas Electronics
- Size:
- A3
- Date:
- Time:
- Page:
- of
- Product Issue:

### Library data of the parts
J2 = CON-00003310-13: Header,40way,2row,vertical,2.54mm,THT; Gender: male; Current: 3A; DC Resistance: 20m; Operating Voltage Max: 250V; Height: 8.89mm; Operating Temperature Max: 105°C; Operating Temperature Min: -40°C; Pin Count: 40; Qualification: -; DNF: DNF
J3 = CON-00003310-13: Header,40way,2row,vertical,2.54mm,THT; Current: 3A; DC Resistance: 20m; Gender: male; Operating Voltage Max: 250V; Height: 8.89mm; Operating Temperature Max: 105°C; Operating Temperature Min: -40°C; Pin Count: 40; Qualification: -; DNF: DNF
J4 J17 = CON-00003301-13: Header,20way,2row,vertical,2.54mm,THT; Current: 3A; DC Resistance: 20m; Gender: male; Operating Voltage Max: 250V; Height: 8.89mm; Operating Temperature Max: 105°C; Operating Temperature Min: -40°C; Pin Count: 20; Qualification: -; DNF: DNF

## Sheet Gigabit Ethernet.SchDoc
size A3; Company Name: Renesas Electronics America; CompanyURL: www.renesas.com; PageSetup: Record=PageOptions|CenterHorizontal=True|CenterVertical=True|PrintScale=1.00|XCorrection=1.00|YCorrection=1.00|PrintKind=1|BorderSize=5000000|LeftOffset=0|BottomOffset=0|Orientation=2|PaperLength=1000|PaperWidth=1000|Scale=100|PaperSource=7|PrintQuality=-4|MediaType=1|DitherType=10|PaperKind=A5 148x210mm|PrintScaleMode=1; ReleaseDate: 16.09.2025; Version: MP; SheetNumber: 13; SheetTotal: 18; VariantNumber: 0; DSheetNumber: 1
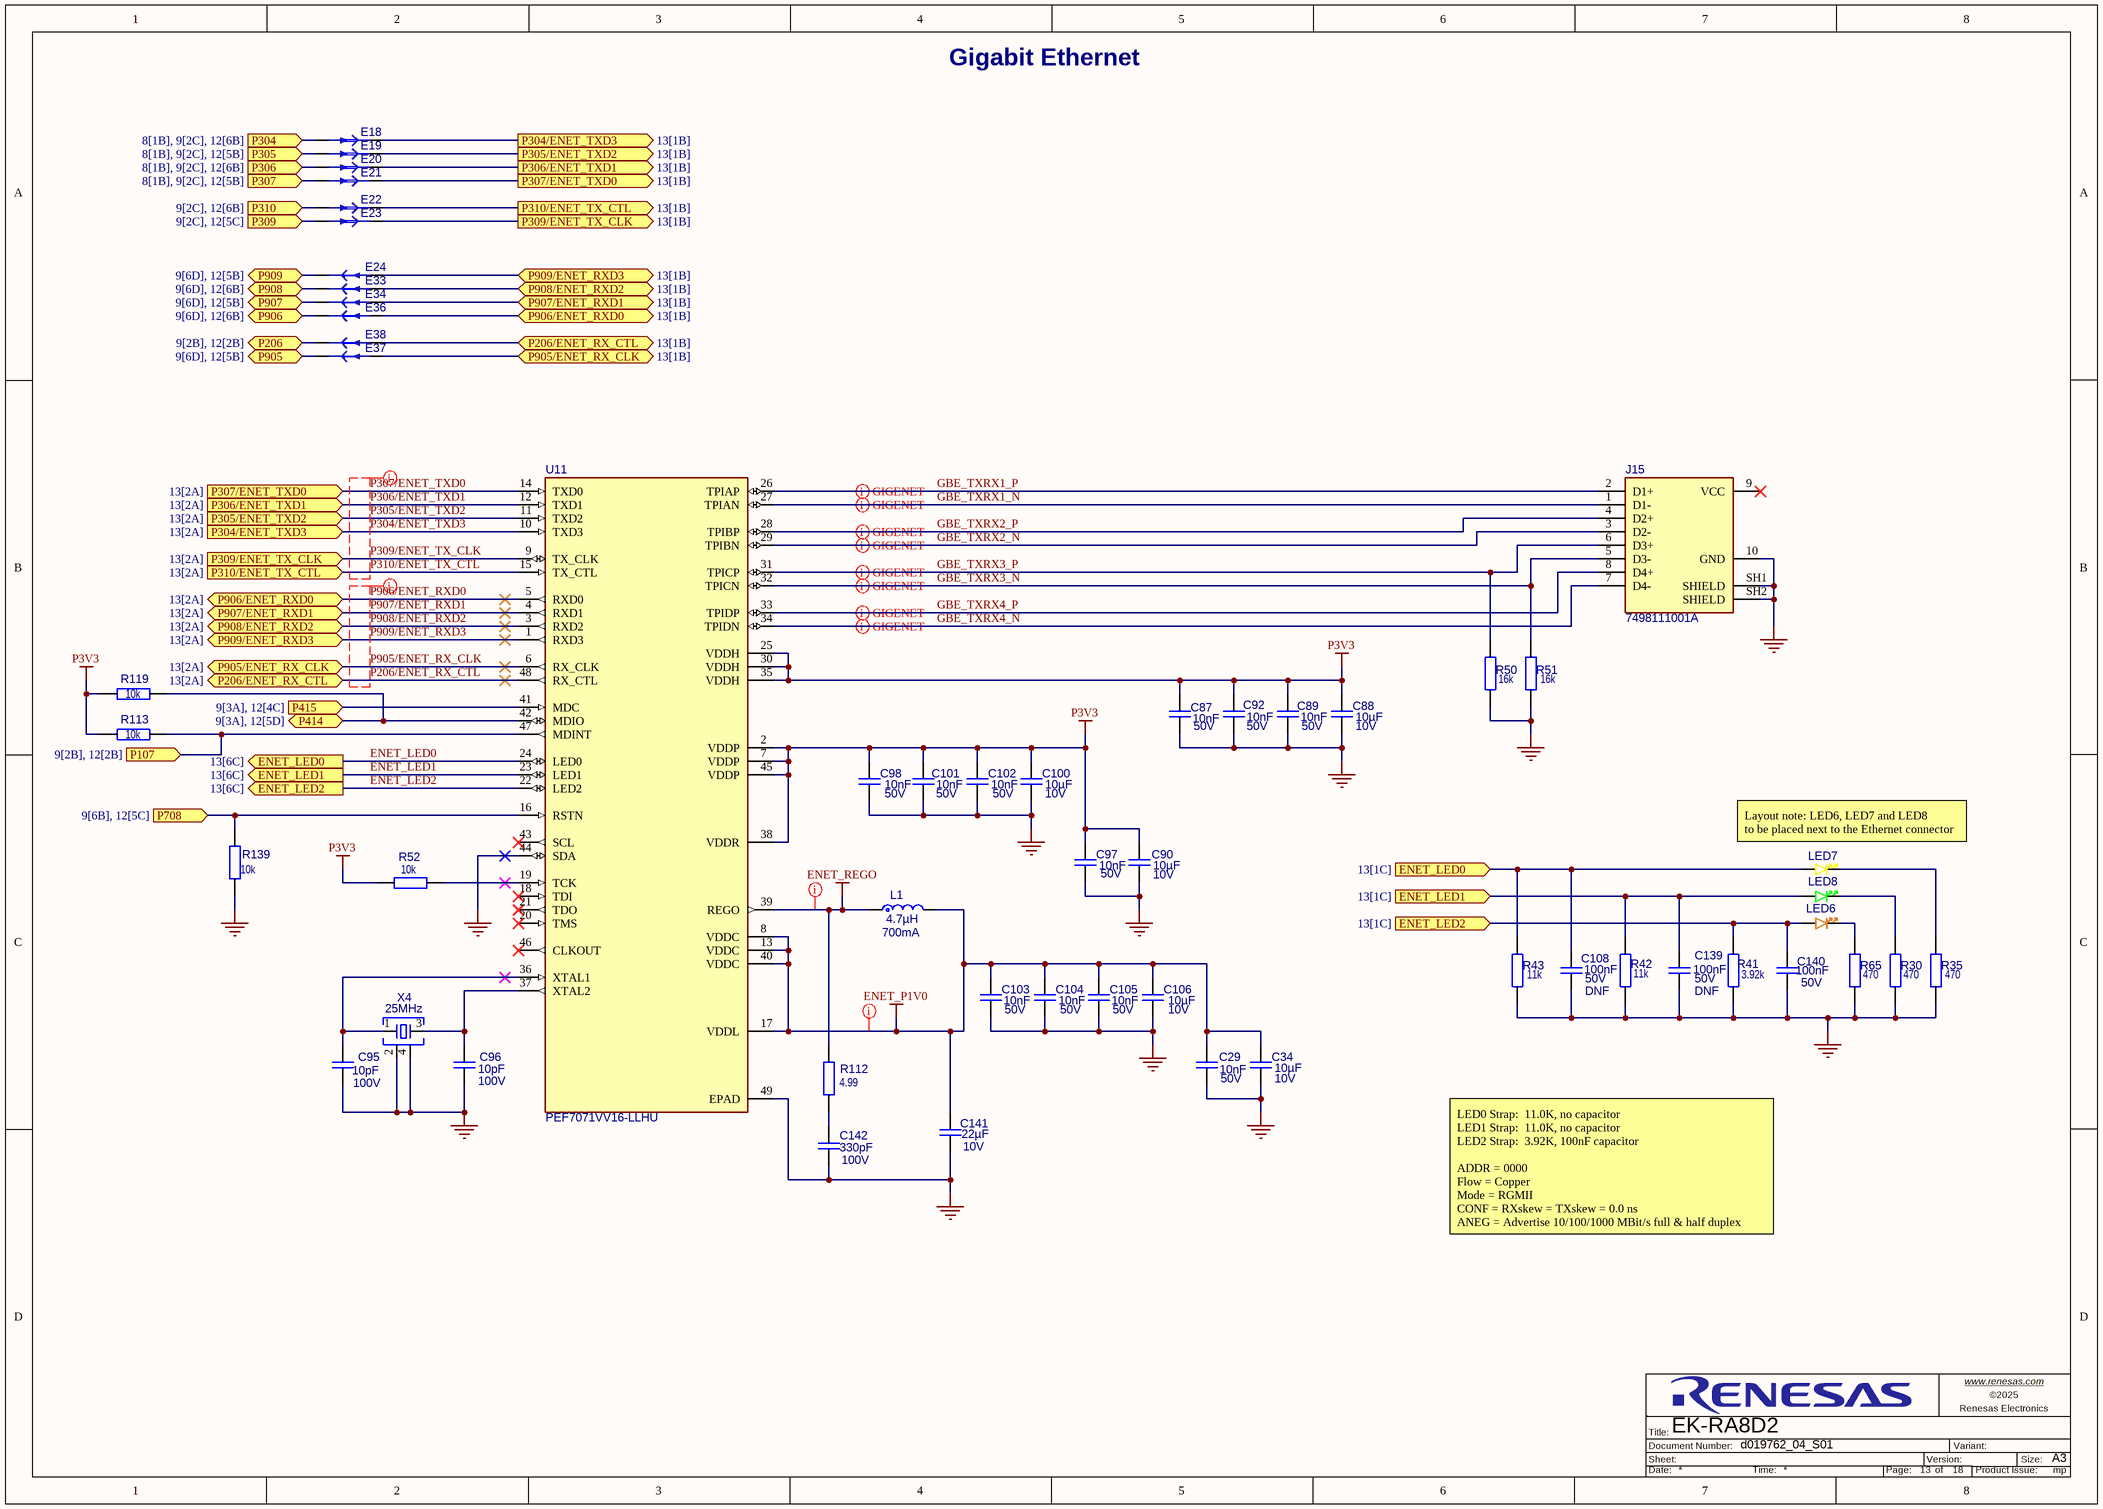
[diagram p12: Gigabit Ethernet.SchDoc]

### Parts
C29  value 10nF  Operating Voltage Max: 50V  [C_EIA0402_0p55]  (hidden comment: Capacitor)
C34  value 10µF  Operating Voltage Max: 10V  [C_EIA0402_0p7]  (hidden comment: Capacitor)
C87  value 10nF  Operating Voltage Max: 50V  [C_EIA0402_0p55]  (hidden comment: Capacitor)
C88  value 10µF  Operating Voltage Max: 10V  [C_EIA0402_0p7]  (hidden comment: Capacitor)
C89  value 10nF  Operating Voltage Max: 50V  [C_EIA0402_0p55]  (hidden comment: Capacitor)
C90  value 10µF  Operating Voltage Max: 10V  [C_EIA0402_0p7]  (hidden comment: Capacitor)
C92  value 10nF  Operating Voltage Max: 50V  [C_EIA0402_0p55]  (hidden comment: Capacitor)
C95  value 10pF  Operating Voltage Max: 100V  [C_EIA0402_0p55]  (hidden comment: Capacitor)
C96  value 10pF  Operating Voltage Max: 100V  [C_EIA0402_0p55]  (hidden comment: Capacitor)
C97  value 10nF  Operating Voltage Max: 50V  [C_EIA0402_0p55]  (hidden comment: Capacitor)
C98  value 10nF  Operating Voltage Max: 50V  [C_EIA0402_0p55]  (hidden comment: Capacitor)
C100  value 10µF  Operating Voltage Max: 10V  [C_EIA0402_0p7]  (hidden comment: Capacitor)
C101  value 10nF  Operating Voltage Max: 50V  [C_EIA0402_0p55]  (hidden comment: Capacitor)
C102  value 10nF  Operating Voltage Max: 50V  [C_EIA0402_0p55]  (hidden comment: Capacitor)
C103  value 10nF  Operating Voltage Max: 50V  [C_EIA0402_0p55]  (hidden comment: Capacitor)
C104  value 10nF  Operating Voltage Max: 50V  [C_EIA0402_0p55]  (hidden comment: Capacitor)
C105  value 10nF  Operating Voltage Max: 50V  [C_EIA0402_0p55]  (hidden comment: Capacitor)
C106  value 10µF  Operating Voltage Max: 10V  [C_EIA0402_0p7]  (hidden comment: Capacitor)
C108  value 100nF  Operating Voltage Max: 50V  [C_EIA0402_0p55]  (hidden comment: Capacitor)
C139  value 100nF  Operating Voltage Max: 50V  [C_EIA0402_0p55]  (hidden comment: Capacitor)
C140  value 100nF  Operating Voltage Max: 50V  [C_EIA0402_0p55]  (hidden comment: Capacitor)
C141  value 22µF  Operating Voltage Max: 10V  [C_EIA0402_0p9]  (hidden comment: Capacitor)
C142  value 330pF  Operating Voltage Max: 100V  [C_EIA0402_0p55]  (hidden comment: GCM155R72A331KA37D)
E18  TRACE_CUT_0805  [trace_cut_0805]  (value not drawn)  (net tie, no BOM)
E19  TRACE_CUT_0805  [trace_cut_0805]  (value not drawn)  (net tie, no BOM)
E20  TRACE_CUT_0805  [trace_cut_0805]  (value not drawn)  (net tie, no BOM)
E21  TRACE_CUT_0805  [trace_cut_0805]  (value not drawn)  (net tie, no BOM)
E22  TRACE_CUT_0805  [trace_cut_0805]  (value not drawn)  (net tie, no BOM)
E23  TRACE_CUT_0805  [trace_cut_0805]  (value not drawn)  (net tie, no BOM)
E24  TRACE_CUT_0805  [trace_cut_0805]  (value not drawn)  (net tie, no BOM)
E33  TRACE_CUT_0805  [trace_cut_0805]  (value not drawn)  (net tie, no BOM)
E34  TRACE_CUT_0805  [trace_cut_0805]  (value not drawn)  (net tie, no BOM)
E36  TRACE_CUT_0805  [trace_cut_0805]  (value not drawn)  (net tie, no BOM)
E37  TRACE_CUT_0805  [trace_cut_0805]  (value not drawn)  (net tie, no BOM)
E38  TRACE_CUT_0805  [trace_cut_0805]  (value not drawn)  (net tie, no BOM)
J15  7498111001A  [wue_7498111001A]
L1  value 4.7µH  Current: 700mA  [L_EIA0805]  (hidden comment: Inductor)
LED6  LO L29K-H2L1-24  [led_0603_o]  (value not drawn)
LED7  150060YS75000  [led_0603_y]  (value not drawn)
LED8  LG L29K-G2J1-24  [led_0603_g]  (value not drawn)
R30  value 470  [R_EIA0402]  (hidden comment: Resistor)
R35  value 470  [R_EIA0402]  (hidden comment: Resistor)
R41  value 3.92k  [R_EIA0402]  (hidden comment: Resistor)
R42  value 11k  [R_EIA0402]  (hidden comment: Resistor)
R43  value 11k  [R_EIA0402]  (hidden comment: Resistor)
R50  value 16k  [R_EIA0402]  (hidden comment: Resistor)
R51  value 16k  [R_EIA0402]  (hidden comment: Resistor)
R52  value 10k  [R_EIA0402]  (hidden comment: Resistor)
R65  value 470  [R_EIA0402]  (hidden comment: Resistor)
R112  value 4.99  [R_EIA0402]  (hidden comment: Resistor)
R113  value 10k  [R_EIA0402]  (hidden comment: Resistor)
R119  value 10k  [R_EIA0402]  (hidden comment: Resistor)
R139  value 10k  [R_EIA0402]  (hidden comment: RC0402FR-0710KL)
U11  PEF7071VV16-LLHU  [mxl_PG-VQFN-48_7x7]
X4  value 25MHz  [ecs-ECX-1637B]  (hidden comment: ECS-250-10-37B-CTN-TR)

### Ports
ENET_LED0 (in, see 13[1C]), ENET_LED0 (out, see 13[6C]), ENET_LED1 (in, see 13[1C]), ENET_LED1 (out, see 13[6C]), ENET_LED2 (in, see 13[1C]), ENET_LED2 (out, see 13[6C]), P107 (in, see 9[2B], 12[2B]), P206 (bidir, see 9[2B], 12[2B]), P206/ENET_RX_CTL (bidir, see 13[1B]), P206/ENET_RX_CTL (bidir, see 13[2A]), P304 (in, see 8[1B], 9[2C], 12[6B]), P304/ENET_TXD3 (in, see 13[2A]), P304/ENET_TXD3 (out, see 13[1B]), P305 (in, see 8[1B], 9[2C], 12[5B]), P305/ENET_TXD2 (in, see 13[2A]), P305/ENET_TXD2 (out, see 13[1B]), P306 (in, see 8[1B], 9[2C], 12[6B]), P306/ENET_TXD1 (in, see 13[2A]), P306/ENET_TXD1 (out, see 13[1B]), P307 (in, see 8[1B], 9[2C], 12[5B]), P307/ENET_TXD0 (in, see 13[2A]), P307/ENET_TXD0 (out, see 13[1B]), P309 (in, see 9[2C], 12[5C]), P309/ENET_TX_CLK (in, see 13[2A]), P309/ENET_TX_CLK (out, see 13[1B]), P310 (in, see 9[2C], 12[6B]), P310/ENET_TX_CTL (in, see 13[2A]), P310/ENET_TX_CTL (out, see 13[1B]), P414 (bidir, see 9[3A], 12[5D]), P415 (in, see 9[3A], 12[4C]), P708 (in, see 9[6B], 12[5C]), P905 (bidir, see 9[6D], 12[5B]), P905/ENET_RX_CLK (bidir, see 13[1B]), P905/ENET_RX_CLK (bidir, see 13[2A]), P906 (bidir, see 9[6D], 12[6B]), P906/ENET_RXD0 (bidir, see 13[1B]), P906/ENET_RXD0 (bidir, see 13[2A]), P907 (bidir, see 9[6D], 12[5B]), P907/ENET_RXD1 (bidir, see 13[1B]), P907/ENET_RXD1 (bidir, see 13[2A]), P908 (bidir, see 9[6D], 12[6B]), P908/ENET_RXD2 (bidir, see 13[1B]), P908/ENET_RXD2 (bidir, see 13[2A]), P909 (bidir, see 9[6D], 12[5B]), P909/ENET_RXD3 (bidir, see 13[1B]), P909/ENET_RXD3 (bidir, see 13[2A])

### Nets
ENET_P1V0: C29.1 C34.1 C103.1 C104.1 C105.1 C106.1 C141.2 L1.2 U11.8(VDDC) U11.13(VDDC) U11.17(VDDL) U11.40(VDDC)
ENET_REGO: L1.1 R112.2 U11.39(REGO)
GND: C29.2 C34.2 C87.2 C88.2 C89.2 C90.2 C92.2 C95.1 C96.2 C97.2 C98.2 C100.2 C101.2 C102.2 C103.2 C104.2 C105.2 C106.2 C108.2 C139.2 C140.2 C141.1 C142.1 J15.10(GND) J15.SH1(SHIELD) J15.SH2(SHIELD) R30.1 R35.1 R41.1 R42.1 R43.1 R50.1 R51.1 R65.1 R139.1 U11.44(SDA) U11.49(EPAD) X4.2 X4.4
P3V3: C87.1 C88.1 C89.1 C90.1 C92.1 C97.1 C98.1 C100.1 C101.1 C102.1 R52.1 R113.1 R119.1 U11.2(VDDP) U11.7(VDDP) U11.25(VDDH) U11.30(VDDH) U11.35(VDDH) U11.38(VDDR) U11.45(VDDP)
ENET_LED0: C108.1 LED7.2(A) R43.2 U11.24(LED0) ; port ENET_LED0
ENET_LED1: C139.1 LED8.2(A) R42.2 U11.23(LED1) ; port ENET_LED1
ENET_LED2: C140.1 LED6.2(A) R41.2 U11.22(LED2) ; port ENET_LED2
GBE_TXRX1_N: J15.1(D1-) U11.27(TPIAN)
GBE_TXRX1_P: J15.2(D1+) U11.26(TPIAP)
GBE_TXRX2_N: J15.3(D2-) U11.29(TPIBN)
GBE_TXRX2_P: J15.4(D2+) U11.28(TPIBP)
GBE_TXRX3_N: J15.5(D3-) R51.2 U11.32(TPICN)
GBE_TXRX3_P: J15.6(D3+) R50.2 U11.31(TPICP)
GBE_TXRX4_N: J15.7(D4-) U11.34(TPIDN)
GBE_TXRX4_P: J15.8(D4+) U11.33(TPIDP)
P107: R113.2 U11.47(MDINT) ; port P107
P206: E38.1 ; port P206
P206/ENET_RX_CTL: E38.2 U11.48(RX_CTL) ; port P206/ENET_RX_CTL
P304: E18.2 ; port P304
P304/ENET_TXD3: E18.1 U11.10(TXD3) ; port P304/ENET_TXD3
P305: E19.2 ; port P305
P305/ENET_TXD2: E19.1 U11.11(TXD2) ; port P305/ENET_TXD2
P306: E20.2 ; port P306
P306/ENET_TXD1: E20.1 U11.12(TXD1) ; port P306/ENET_TXD1
P307: E21.2 ; port P307
P307/ENET_TXD0: E21.1 U11.14(TXD0) ; port P307/ENET_TXD0
P309: E23.2 ; port P309
P309/ENET_TX_CLK: E23.1 U11.9(TX_CLK) ; port P309/ENET_TX_CLK
P310: E22.2 ; port P310
P310/ENET_TX_CTL: E22.1 U11.15(TX_CTL) ; port P310/ENET_TX_CTL
P414: R119.2 U11.42(MDIO) ; port P414
P415: U11.41(MDC) ; port P415
P708: R139.2 U11.16(RSTN) ; port P708
P905: E37.1 ; port P905
P905/ENET_RX_CLK: E37.2 U11.6(RX_CLK) ; port P905/ENET_RX_CLK
P906: E36.1 ; port P906
P906/ENET_RXD0: E36.2 U11.5(RXD0) ; port P906/ENET_RXD0
P907: E34.1 ; port P907
P907/ENET_RXD1: E34.2 U11.4(RXD1) ; port P907/ENET_RXD1
P908: E33.1 ; port P908
P908/ENET_RXD2: E33.2 U11.3(RXD2) ; port P908/ENET_RXD2
P909: E24.1 ; port P909
P909/ENET_RXD3: E24.2 U11.1(RXD3) ; port P909/ENET_RXD3
NetC95_2: C95.2 U11.36(XTAL1) X4.1
NetC96_1: C96.1 U11.37(XTAL2) X4.3
NetC142_2: C142.2 R112.1
NetLED6_1: LED6.1(K) R65.2
NetLED7_1: LED7.1(K) R35.2
NetLED8_1: LED8.1(K) R30.2
NetR52_2: R52.2 U11.19(TCK)

Not connected (* = marked no-connect by the designer): J15 9(VCC)*; U11 18(TDI)* 20(TMS)* 21(TDO)* 43(SCL)* 46(CLKOUT)*

### Layout directives
differential pair; net class GigENET; differential pair class GBE_TXRX1: GBE_TXRX1_N, GBE_TXRX1_P
differential pair; net class GigENET; differential pair class GBE_TXRX2: GBE_TXRX2_N, GBE_TXRX2_P
differential pair; net class GigENET; differential pair class GBE_TXRX3: GBE_TXRX3_N, GBE_TXRX3_P
differential pair; net class GigENET; differential pair class GBE_TXRX4: GBE_TXRX4_N, GBE_TXRX4_P
net class Power; rule Supply Nets [Voltage = 1.000]: ENET_P1V0, ENET_REGO
net class RGMII_RX: P206/ENET_RX_CTL, P905/ENET_RX_CLK, P906/ENET_RXD0, P907/ENET_RXD1, P908/ENET_RXD2, P909/ENET_RXD3
net class RGMII_TX: P304/ENET_TXD3, P305/ENET_TXD2, P306/ENET_TXD1, P307/ENET_TXD0, P309/ENET_TX_CLK, P310/ENET_TX_CTL

### Notes on the sheet
- Gigabit Ethernet
- (near LED7) Layout note: LED6, LED7 and LED8
  to be placed next to the Ethernet connector
- LED0 Strap:  11.0K, no capacitor
  LED1 Strap:  11.0K, no capacitor
  LED2 Strap:  3.92K, 100nF capacitor
  ADDR = 0000
  Flow = Copper
  Mode = RGMII
  CONF = RXskew = TXskew = 0.0 ns
  ANEG = Advertise 10/100/1000 MBit/s full & half duplex
- www.renesas.com <http://www.renesas.com>
- Sheet:
- Title:
- Document Number:
- Version:
- Variant:
- Renesas Electronics
- Size:
- A3
- Date:
- Time:
- Page:
- of
- Product Issue:

### Library data of the parts
C29 C87 C89 C92 C97 C98 C101-C105 = CAP-00003212-9: Capacitor,EIA0402,10n,50V,X7R; Tolerance: 10%; Qualification: AEC-Q200; Subtype: MLCC; Dielectric: X7R; Height: 550µm; Operating Temperature Max: 125°C; Operating Temperature Min: -55°C
C34 C88 C90 C100 C106 = CAP-00003447-8: Capacitor,EIA0402,10u,10V,X5R; Tolerance: 20%; Subtype: MLCC; Dielectric: X5R; Height: 700µm; Operating Temperature Max: 85°C; Operating Temperature Min: -55°C; Qualification: -
C95 C96 = CAP-00003215-9: Capacitor,EIA0402,10p,100V,C0G; Tolerance: 5%; Qualification: AEC-Q200; Subtype: MLCC; Dielectric: C0G; Height: 550µm; Operating Temperature Max: 125°C; Operating Temperature Min: -55°C
C108 C139 C140 = CAP-00003203-9: Capacitor,EIA0402,100n,50V,X7R; Tolerance: 10%; Qualification: AEC-Q200; Subtype: MLCC; Dielectric: X7R; Height: 550µm; Operating Temperature Max: 125°C; Operating Temperature Min: -55°C
  C108 C139: DNF: DNF
C141 = CAP-00000013-4: Capacitor,EIA0402,22u,10V,X5R; Tolerance: 20%; Subtype: MLCC; Dielectric: X5R; Height: 900µm; Operating Temperature Max: 85°C; Operating Temperature Min: -55°C; Qualification: -
C142 = CAP-00000002-8: Capacitor,EIA0402,330p,100V,X7R; Tolerance: 10%; Qualification: AEC-Q200; Subtype: MLCC; Dielectric: X7R; Height: 550µm; Operating Temperature Max: 125°C; Operating Temperature Min: -55°C
E18-E24 E33 E34 E36-E38 = MIS-00000000-11: Trace Cut, SMD, 0805 size; Value: TC; Pin Count: 2; Qualification: -; Subtype: Trace Cut
J15 = CON-00000088-4: 10/100/1000 Ethernet Jack, RJ45, Right Angle SMT, No LEDs; Gender: female; Operating Temperature Min: -40°C; Qualification: -; Operating Temperature Max: 85°C; Pin Count: 10; Height: 13.55mm
L1 = IND-00000002-6: Power Inductor Shielded Multilayer 4.7uH 20% 3MHz Ferrite 700mA; DC Resistance: 0.26; Subtype: Fixed; Tolerance: 20%; Frequency: 3MHz; Height: 1mm; Operating Temperature Max: 125°C; Operating Temperature Min: -55°C; Qualification: -
LED6 = DIO-00003241-14: Standard LEDs - SMD Orange, 606nm 3.55 to 14 mcd; Qualification: AEC-Q101; Reverse Voltage: 12V; Current: 2mA; Subtype: LED; Forward Voltage: 1.8V; Operating Temperature Min: -40°C; Operating Temperature Max: 100°C; Height: 650µm
LED7 = DIO-00000015-5: Standard LEDs - SMD Yellow, 590nm 90 to 120 mcd; Subtype: LED; Reverse Voltage: 5V; Current: 30mA; Forward Voltage: 2V; Operating Temperature Min: -40°C; Height: 800µm; Qualification: -; Operating Temperature Max: 85°C
LED8 = DIO-00003239-15: Standard LEDs - SMD Green, 570nm 2.2 to 5.6 mcd; Current: 2mA; Forward Voltage: 1.7V; Qualification: AEC-Q101; Reverse Voltage: 12V; Subtype: LED; Height: 650µm; Operating Temperature Max: 100°C; Operating Temperature Min: -40°C
R30 R35 R65 = RES-00000870-9: Resistor,EIA0402,470,0.0625W; Power: 62.5mW; Tolerance: 1%; Subtype: Chip Resistor; Operating Temperature Max: 155°C; Operating Temperature Min: -55°C; Qualification: -
R41 = RES-00001635-10: Resistor,EIA0402,3.92k,0.0625W; Power: 62.5mW; Tolerance: 1%; Subtype: Chip Resistor; Operating Temperature Max: 155°C; Operating Temperature Min: -55°C; Qualification: -
R42 R43 = RES-00000903-9: Resistor,EIA0402,11k,0.0625W; Power: 62.5mW; Tolerance: 1%; Subtype: Chip Resistor; Operating Temperature Max: 155°C; Operating Temperature Min: -55°C; Qualification: -
R50 R51 = RES-00000907-9: Resistor,EIA0402,16k,0.0625W; Power: 62.5mW; Tolerance: 1%; Subtype: Chip Resistor; Operating Temperature Max: 155°C; Operating Temperature Min: -55°C; Qualification: -
R52 R113 R119 R139 = RES-00000902-9: Resistor,EIA0402,10k,0.0625W; Power: 62.5mW; Tolerance: 1%; Subtype: Chip Resistor; Operating Temperature Max: 155°C; Operating Temperature Min: -55°C; Qualification: -
R112 = RES-00001375-9: Resistor,EIA0402,4.99,0.0625W; Power: 62.5mW; Tolerance: 1%; Subtype: Chip Resistor; Operating Temperature Max: 155°C; Operating Temperature Min: -55°C; Qualification: -
U11 = ICS-00000025-10: Ethernet Network Connection GPY111 Gigabit Ethernet (GbE); Operating Voltage Max: 3.47V; Operating Voltage Min: 2.37V; Subtype: Transceiver; Operating Temperature Min: -40°C; Pin Count: 49; Operating Temperature Max: 85°C; Qualification: -
X4 = CRY-00000003-9: Crystal, 25.000MHz, 10 pF, 2x1.6; Load Capacitance: 10pF; Tolerance: 10ppm; Height: 500µm; Operating Temperature Max: 85°C; Operating Temperature Min: -40°C; Qualification: -; Subtype: Crystal